# EAGLE design 16_FLAGS_Z_S (EAGLE 7.5.0)
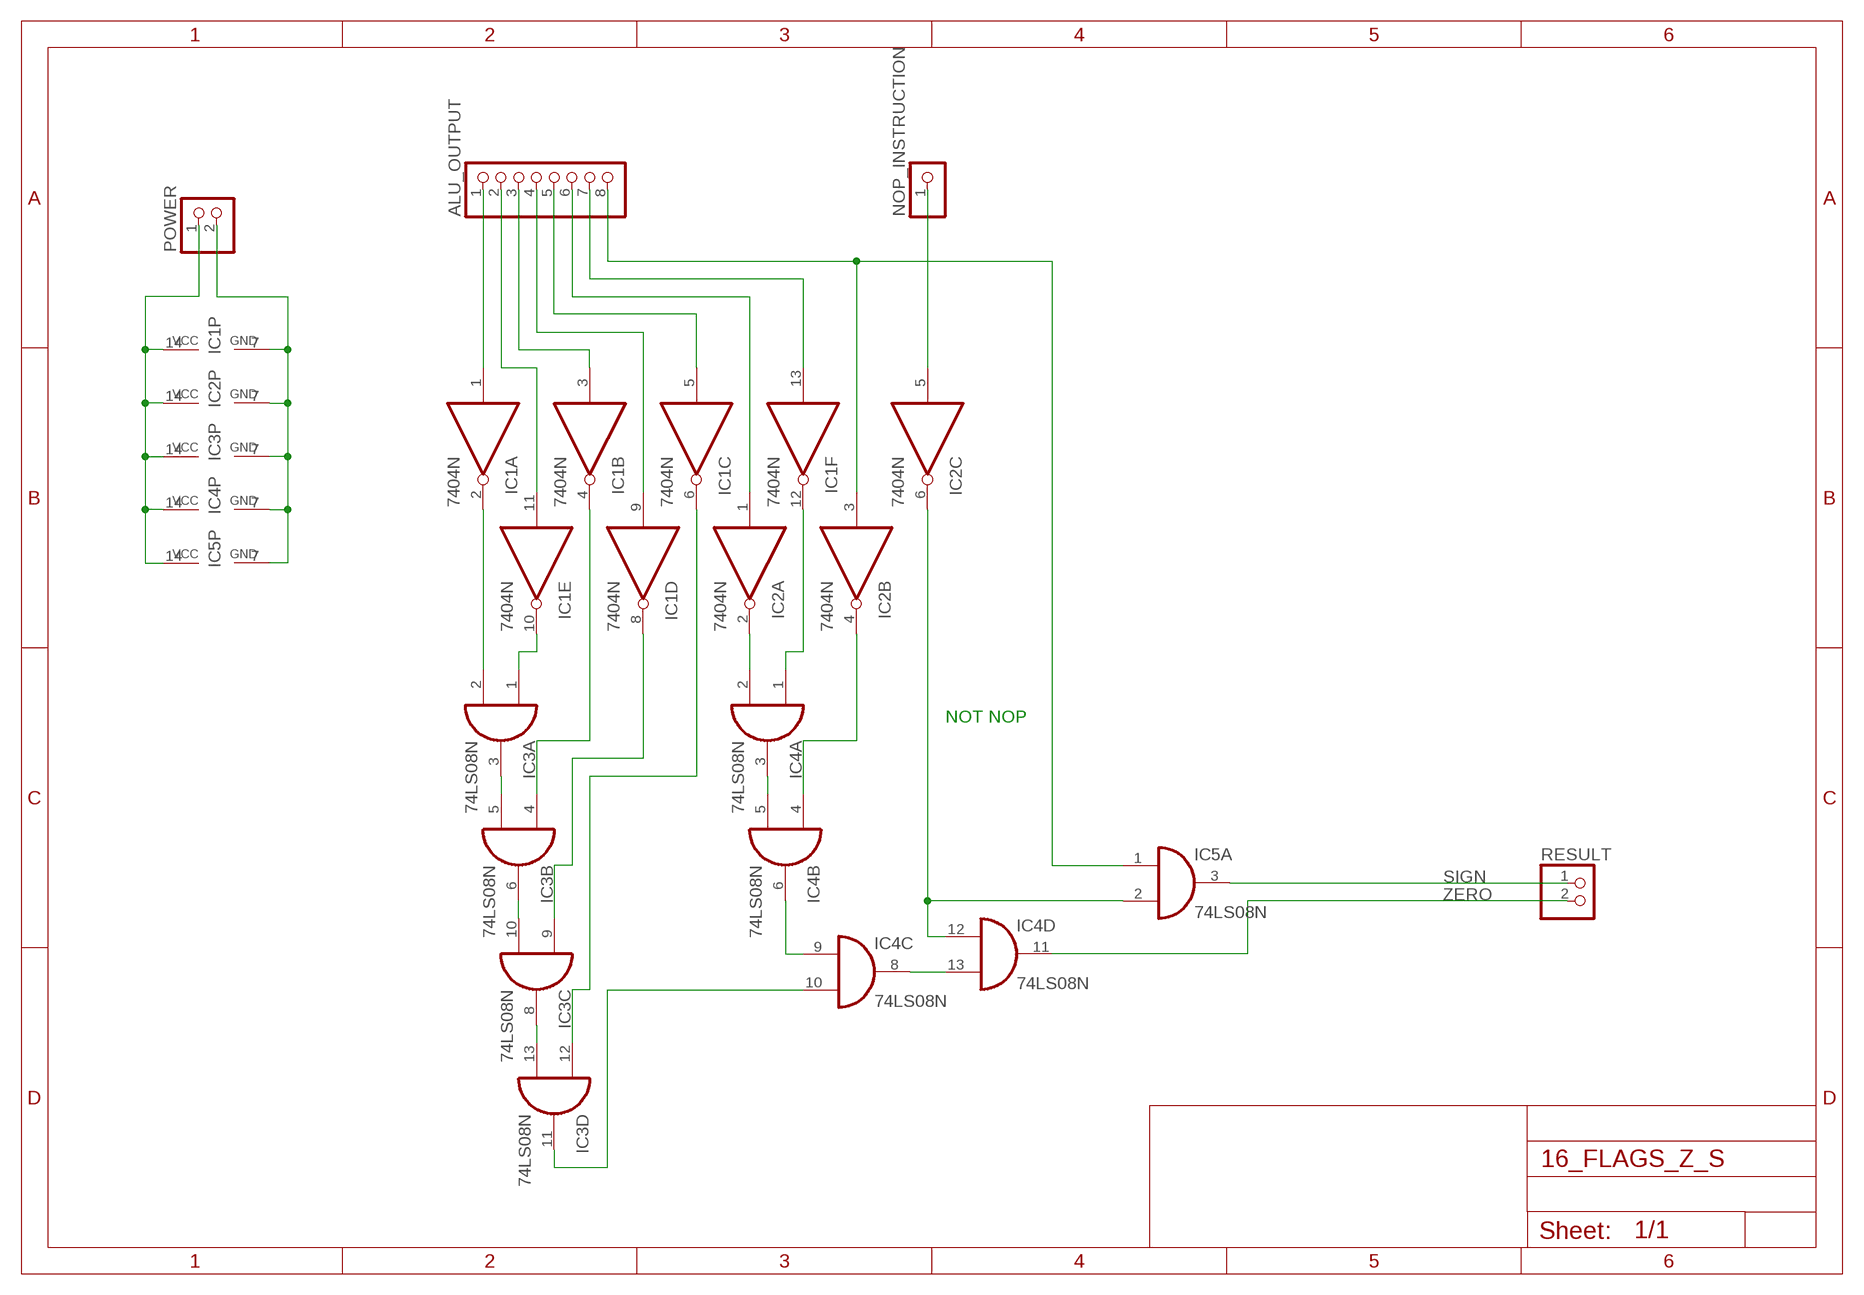
[diagram p0: schematic, sheet 1]

## Parts
ALU_OUTPUT  PINHD-1X8  [1X08]
IC1  7404N  [DIL14]
IC2  7404N  [DIL14]
IC3  74LS08N  [DIL14]
IC4  74LS08N  [DIL14]
IC5  74LS08N  [DIL14]
NOP_INSTRUCTION  PINHD-1X1  [1X01]
POWER  PINHD-1X2  [1X02]
RESULT  PINHD-1X2  [1X02]

## Nets
ALU_OUTPUT_1: ALU_OUTPUT.1 IC1.1(A:I)
ALU_OUTPUT_2: ALU_OUTPUT.2 IC1.11(E:I)
ALU_OUTPUT_3: ALU_OUTPUT.3 IC1.3(B:I)
ALU_OUTPUT_4: ALU_OUTPUT.4 IC1.9(D:I)
ALU_OUTPUT_5: ALU_OUTPUT.5 IC1.5(C:I)
ALU_OUTPUT_6: ALU_OUTPUT.6 IC2.1(A:I)
ALU_OUTPUT_7: ALU_OUTPUT.7 IC1.13(F:I)
ALU_OUTPUT_8: ALU_OUTPUT.8 IC2.3(B:I) IC5.1(A:I0)
GND: IC1.7(P:GND) IC2.7(P:GND) IC3.7(P:GND) IC4.7(P:GND) IC5.7(P:GND) POWER.2
N$4: IC1.10(E:O) IC3.1(A:I0)
N$10: IC1.2(A:O) IC3.2(A:I1)
N$11: IC1.4(B:O) IC3.4(B:I0)
N$12: IC1.6(C:O) IC3.12(D:I0)
N$13: IC1.12(F:O) IC4.1(A:I0)
N$14: IC3.3(A:O) IC3.5(B:I1)
N$15: IC3.6(B:O) IC3.10(C:I1)
N$16: IC1.8(D:O) IC3.9(C:I0)
N$17: IC3.8(C:O) IC3.13(D:I1)
N$18: IC2.2(A:O) IC4.2(A:I1)
N$19: IC4.3(A:O) IC4.5(B:I1)
N$20: IC2.4(B:O) IC4.4(B:I0)
N$21: IC4.6(B:O) IC4.9(C:I0)
N$22: IC3.11(D:O) IC4.10(C:I1)
N$24: IC2.6(C:O) IC4.12(D:I0) IC5.2(A:I1)
N$25: IC4.8(C:O) IC4.13(D:I1)
NOP_INSTRUCTION: IC2.5(C:I) NOP_INSTRUCTION.1
SIGN: IC5.3(A:O) RESULT.1
VCC: IC1.14(P:VCC) IC2.14(P:VCC) IC3.14(P:VCC) IC4.14(P:VCC) IC5.14(P:VCC) POWER.1
ZERO: IC4.11(D:O) RESULT.2
Unconnected: IC2.8(D:O) IC2.9(D:I) IC2.10(E:O) IC2.11(E:I) IC2.12(F:O) IC2.13(F:I) IC5.4(B:I0) IC5.5(B:I1) IC5.6(B:O) IC5.8(C:O) IC5.9(C:I0) IC5.10(C:I1) IC5.11(D:O) IC5.12(D:I0) IC5.13(D:I1)

## Notes on the sheet
- NOT NOP

## Library data of the parts
ALU_OUTPUT = pinhead:PINHD-1X8: PIN HEADER
IC1 IC2 = 74xx-eu:74*04: Hex INVERTER
IC3-IC5 = 74xx-eu:74*08: Quad 2-input AND gate
NOP_INSTRUCTION = pinhead:PINHD-1X1: PIN HEADER
POWER RESULT = pinhead:PINHD-1X2: PIN HEADER

## Board
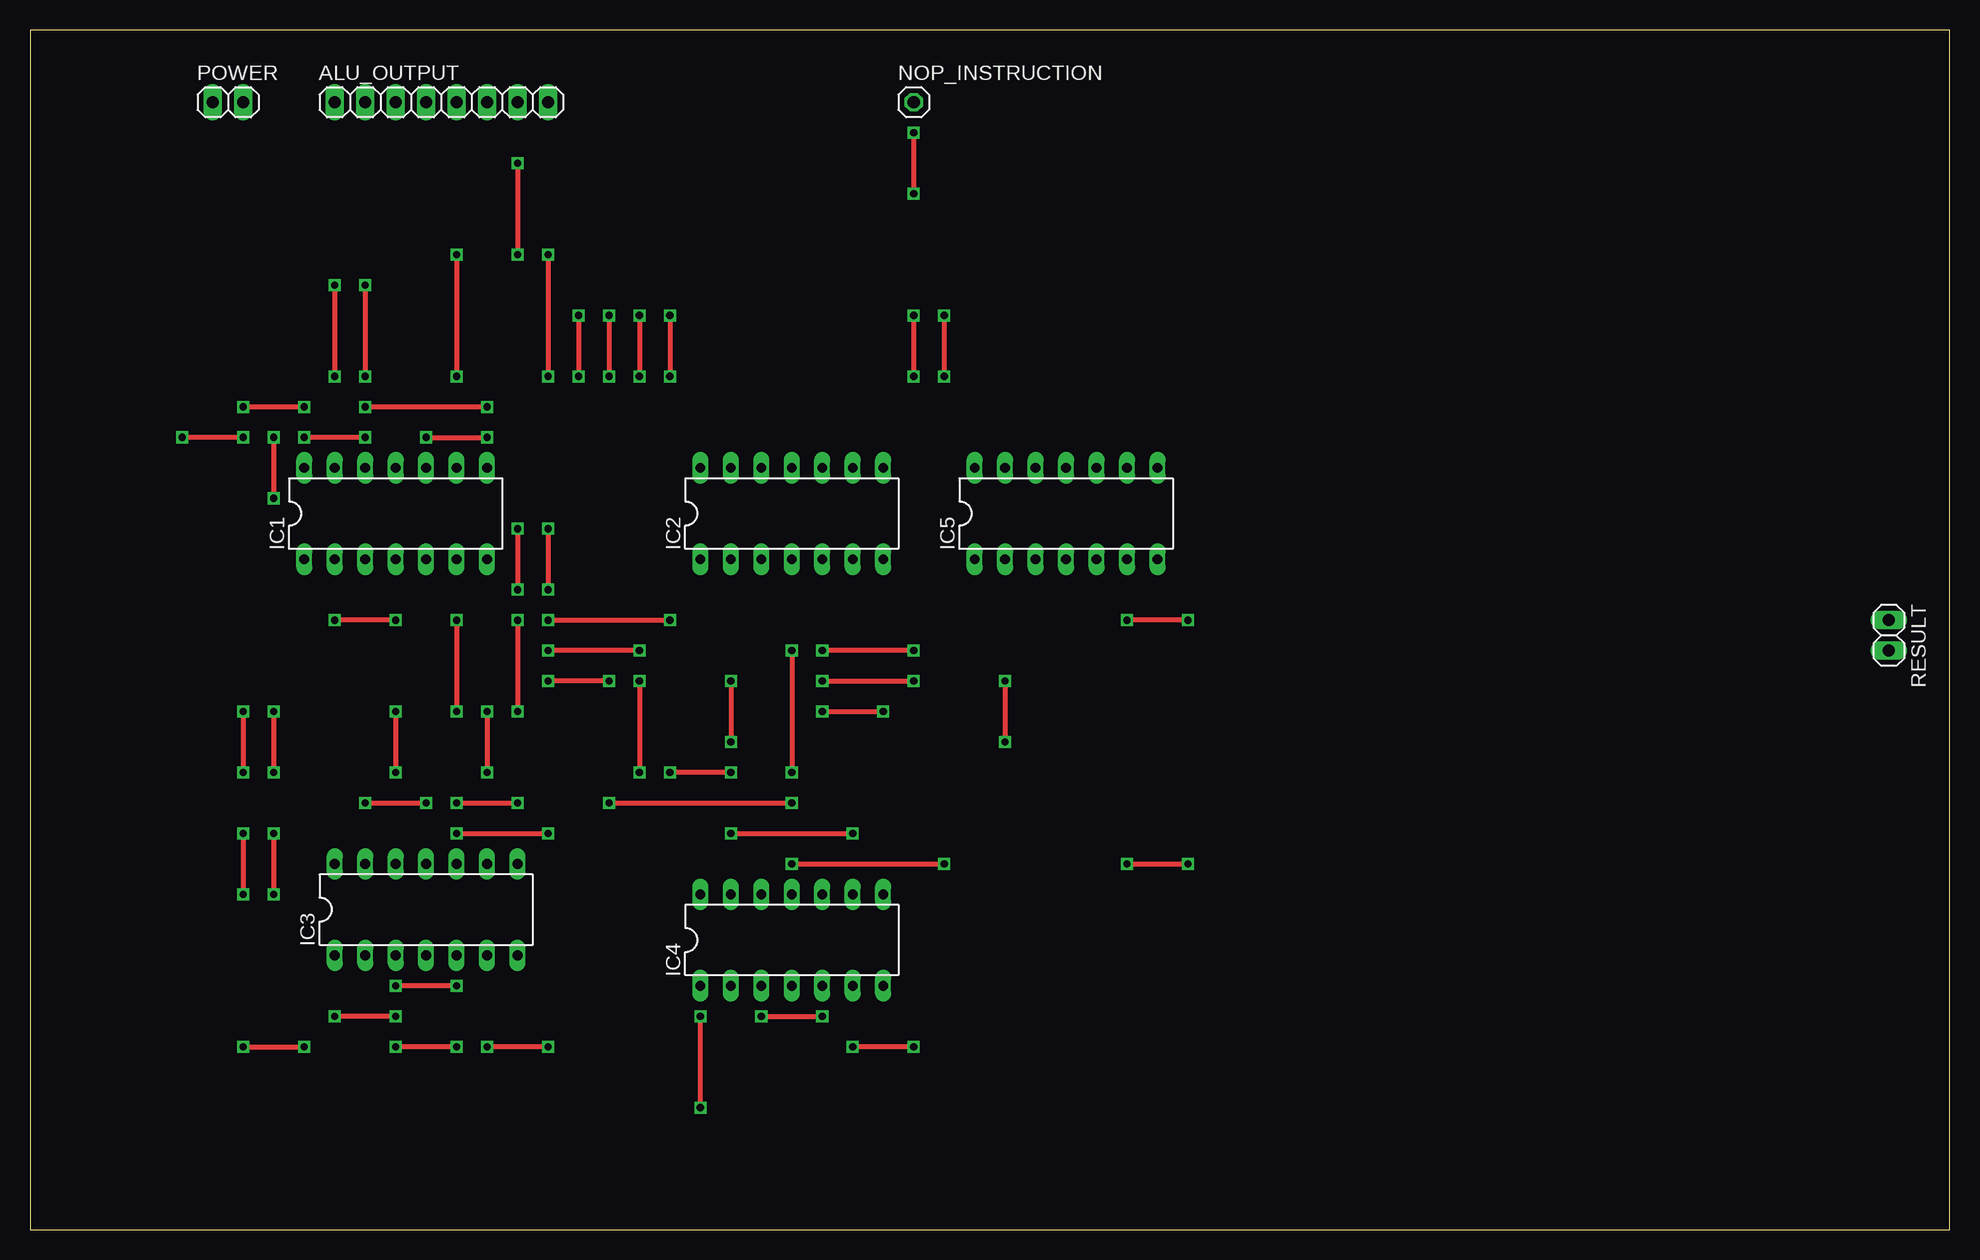
[diagram p1: board, top side]
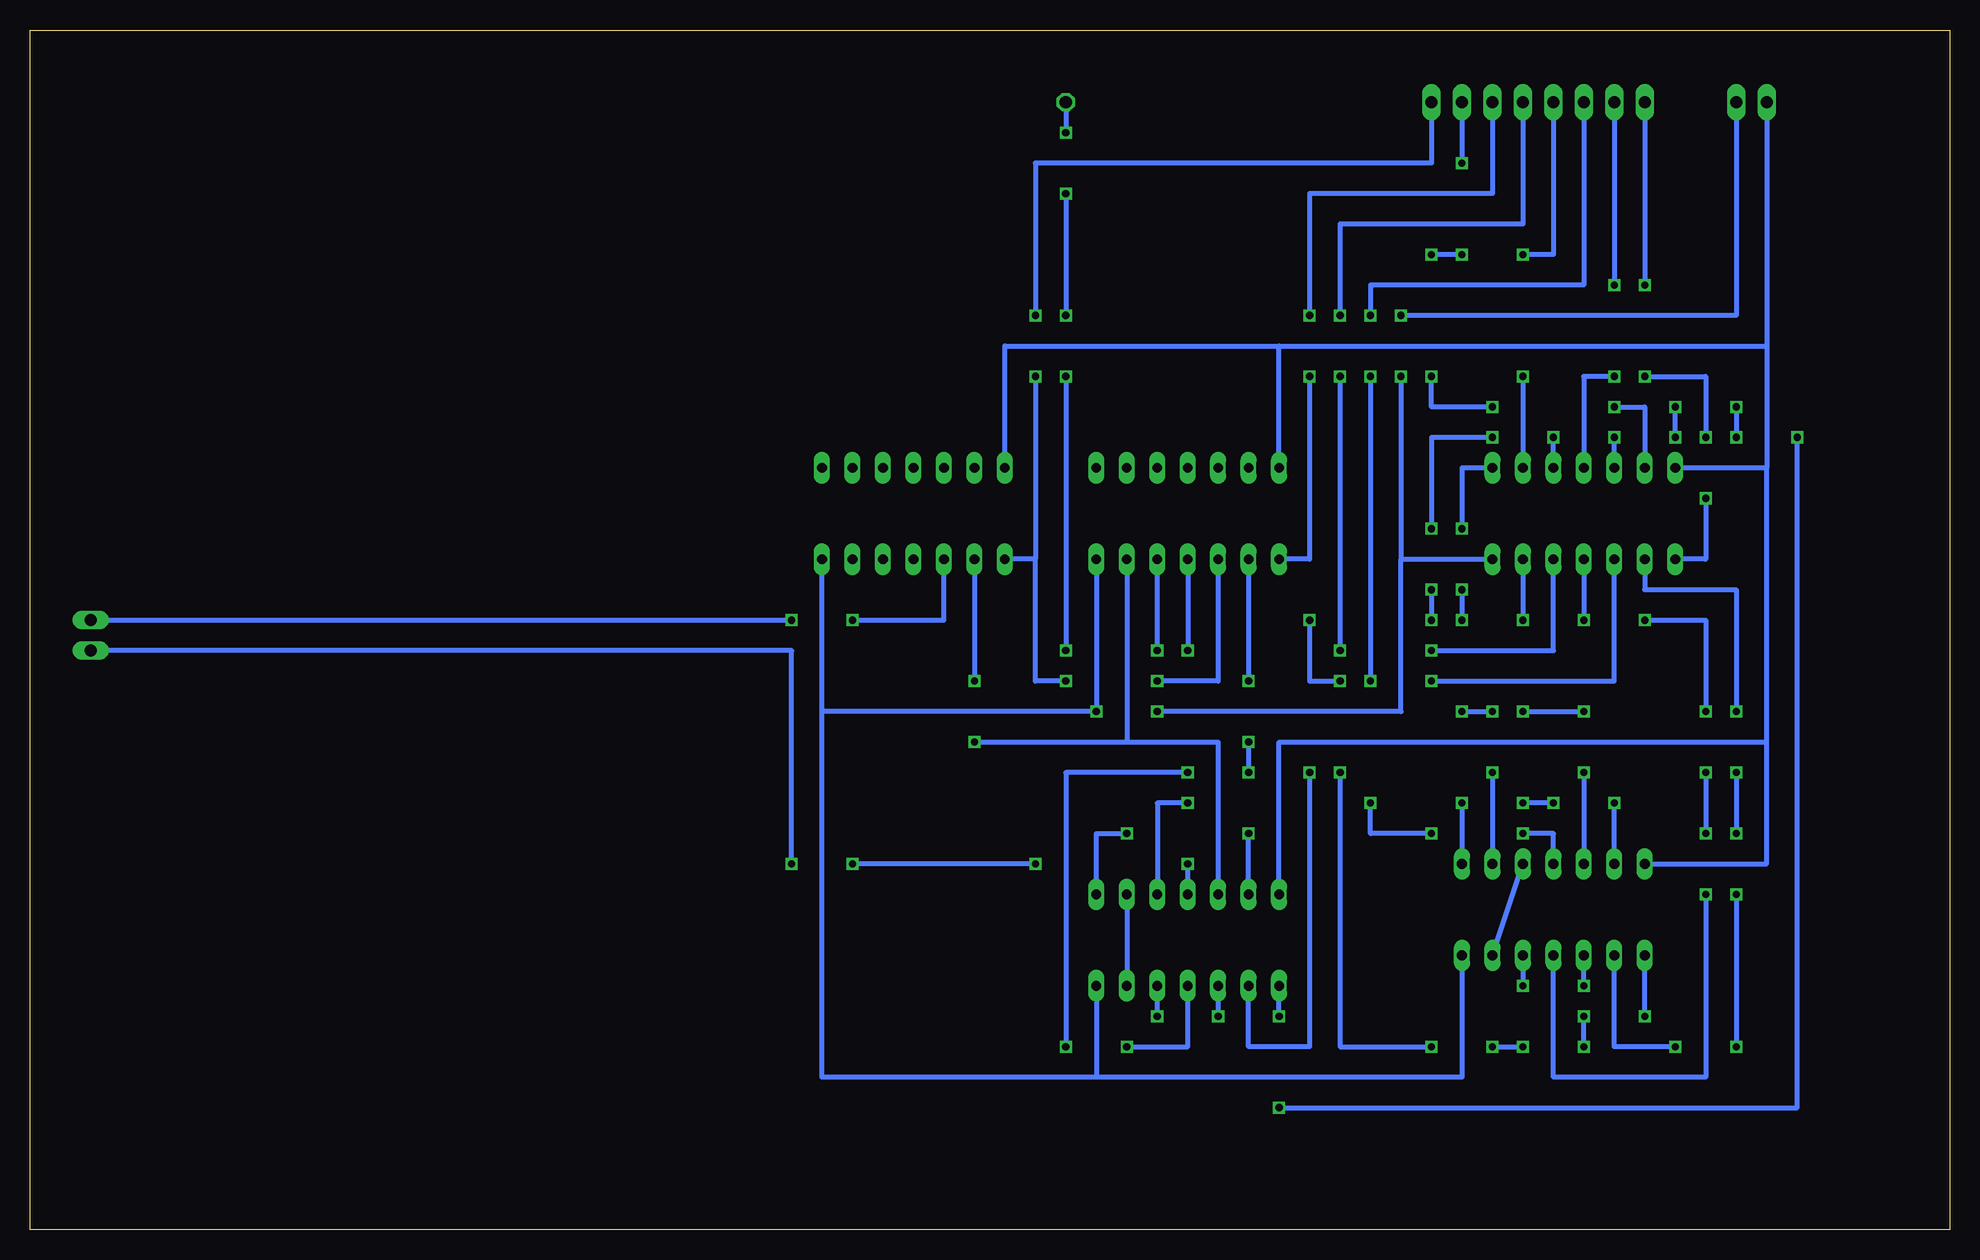
[diagram p2: board, bottom side, seen from below]

Size 160 x 100 mm. Coordinates in mm from the lower left corner, seen from the top.
Outline: 0,0 160,0 160,100 0,100 0,0
Copper layers (1*16): Top 0.035mm / dielectric 1.5mm / Bottom 0.035mm
Design rules "default": minimum track width 10mil, minimum drill 24mil, track to track 8mil, track to pad 8mil, pad to pad 8mil, via to via 8mil, smd to smd 8mil, copper to edge 40mil, drill to drill 8mil, minimum pad ring 10mil, minimum via ring 8mil, stop-mask expansion 4mil, vias tented up to drill 0mil, thermal gap 10mil

### Footprints (pad centres in the part's own frame; a part is rotated, then mirrored left to right if it is on the bottom)
1X08 = drill 1.016 long: 1 -8.89,0; 2 -6.35,0; 3 -3.81,0; 4 -1.27,0; 5 1.27,0; 6 3.81,0; 7 6.35,0; 8 8.89,0
DIL14 = drill 0.813 long: 1 -7.62,-3.81; 2 -5.08,-3.81; 3 -2.54,-3.81; 4 0,-3.81; 5 2.54,-3.81; 6 5.08,-3.81; 7 7.62,-3.81; 8 7.62,3.81; 9 5.08,3.81; 10 2.54,3.81; 11 0,3.81; 12 -2.54,3.81; 13 -5.08,3.81; 14 -7.62,3.81
1X01 = drill 1.016 octagon: 1 0,0
1X02 = drill 1.016 long: 1 -1.27,0; 2 1.27,0

### Placement (x,y rotation side)
ALU_OUTPUT  34.29,93.98 0 top
IC1  30.48,59.69 0 top
IC2  63.5,59.69 0 top
IC3  33.02,26.67 0 top
IC4  63.5,24.13 0 top
IC5  86.36,59.69 0 top
NOP_INSTRUCTION  73.66,93.98 0 top
POWER  16.51,93.98 0 top
RESULT  154.94,49.53 270 top

### Tracks (layer width: path | path; a pad name or v marks a point on that pad's centre or on a via)
ALU_OUTPUT_1  (via drill 0.6)
  Top 0.406: v25.4,78.74 v25.4,71.12 | v20.32,66.04 v20.32,60.96
  Bottom 0.406: ALU_OUTPUT.1 v25.4,78.74 | v25.4,71.12 20.32,71.12 v20.32,66.04 | v20.32,60.96 20.32,55.88 IC1.1
ALU_OUTPUT_2  (via drill 0.6)
  Top 0.406: v27.94,78.74 v27.94,71.12
  Bottom 0.406: ALU_OUTPUT.2 v27.94,78.74 | v27.94,71.12 30.48,71.12 IC1.11
ALU_OUTPUT_3  (via drill 0.6)
  Top 0.406: v48.26,76.2 v48.26,71.12 | v48.26,45.72 v43.18,45.72
  Bottom 0.406: ALU_OUTPUT.3 30.48,78.74 48.26,78.74 v48.26,76.2 | v48.26,71.12 v48.26,45.72 | v43.18,45.72 27.94,45.72 IC1.3
ALU_OUTPUT_4  (via drill 0.6)
  Top 0.406: v35.56,81.28 v35.56,71.12
  Bottom 0.406: ALU_OUTPUT.4 33.02,81.28 v35.56,81.28 | v35.56,71.12 IC1.9
ALU_OUTPUT_5  (via drill 0.6)
  Top 0.406: v50.8,76.2 v50.8,71.12 | v50.8,48.26 v43.18,48.26
  Bottom 0.406: ALU_OUTPUT.5 35.56,83.82 50.8,83.82 v50.8,76.2 | v50.8,71.12 v50.8,48.26 | v43.18,48.26 33.02,48.26 IC1.5
ALU_OUTPUT_6  (via drill 0.6)
  Top 0.406: v53.34,76.2 v53.34,71.12
  Bottom 0.406: ALU_OUTPUT.6 38.1,86.36 53.34,86.36 v53.34,76.2 | v53.34,71.12 53.34,55.88 IC2.1
ALU_OUTPUT_7  (via drill 0.6)
  Top 0.406: v40.64,88.9 v40.64,81.28 | v43.18,81.28 v43.18,71.12 | v38.1,68.58 v27.94,68.58
  Bottom 0.406: ALU_OUTPUT.7 v40.64,88.9 | v40.64,81.28 v43.18,81.28 | v27.94,68.58 25.4,68.58 IC1.13 | v38.1,68.58 43.18,68.58 v43.18,71.12
ALU_OUTPUT_8  (via drill 0.6)
  Top 0.406: v76.2,76.2 v76.2,71.12 | v66.04,45.72 v73.66,45.72
  Bottom 0.406: ALU_OUTPUT.8 43.18,88.9 76.2,88.9 v76.2,76.2 | v76.2,71.12 76.2,55.88 | 76.2,55.88 IC5.1 | IC2.3 60.96,45.72 v66.04,45.72 | v73.66,45.72 76.2,45.72 76.2,55.88
GND  (via drill 0.6)
  Top 0.406: v45.72,76.2 v45.72,71.12 | v66.04,43.18 v71.12,43.18
  Bottom 0.406: POWER.2 17.78,76.2 v45.72,76.2 | v45.72,71.12 45.72,55.88 | 45.72,55.88 IC1.7 | IC2.7 v71.12,43.18 93.98,43.18 | 45.72,55.88 45.72,43.18 v66.04,43.18 | IC3.7 40.64,12.7 71.12,12.7 | 71.12,12.7 93.98,12.7 93.98,43.18 | 93.98,43.18 IC5.7 | IC4.7 71.12,12.7
N$4  (via drill 0.6)
  Top 0.406: v33.02,66.04 v38.1,66.04 | v43.18,58.42 v43.18,53.34 | v43.18,50.8 v53.34,50.8 | v50.8,45.72 v50.8,38.1 | v43.18,15.24 v38.1,15.24 | v35.56,15.24 v30.48,15.24 | v30.48,17.78 v25.4,17.78
  Bottom 0.406: IC1.10 v33.02,66.04 | v38.1,66.04 43.18,66.04 v43.18,58.42 | v43.18,53.34 v43.18,50.8 | v53.34,50.8 53.34,45.72 v50.8,45.72 | v50.8,38.1 50.8,15.24 v43.18,15.24 | v38.1,15.24 v35.56,15.24 | v30.48,15.24 v30.48,17.78 | v25.4,17.78 IC3.1
N$10  (via drill 0.6)
  Top 0.406: v17.78,43.18 v17.78,38.1 | v17.78,33.02 v17.78,27.94 | v17.78,15.24 v22.86,15.24
  Bottom 0.406: IC1.2 25.4,53.34 17.78,53.34 v17.78,43.18 | v17.78,38.1 v17.78,33.02 | v17.78,27.94 v17.78,15.24 | v22.86,15.24 27.94,15.24 IC3.2
N$11  (via drill 0.6)
  Top 0.406: v30.48,50.8 v25.4,50.8 | v20.32,43.18 v20.32,38.1 | v20.32,33.02 v20.32,27.94
  Bottom 0.406: IC1.4 v30.48,50.8 | v25.4,50.8 20.32,50.8 v20.32,43.18 | v20.32,38.1 v20.32,33.02 | v20.32,27.94 20.32,12.7 33.02,12.7 IC3.4
N$12  (via drill 0.6)
  Top 0.406: v35.56,50.8 v35.56,43.18 | v30.48,43.18 v30.48,38.1
  Bottom 0.406: IC1.6 v35.56,50.8 | v35.56,43.18 v30.48,43.18 | v30.48,38.1 IC3.12
N$13  (via drill 0.6)
  Top 0.406: v27.94,66.04 v22.86,66.04 | v22.86,68.58 v17.78,68.58 | v17.78,66.04 v12.7,66.04 | v55.88,10.16 v55.88,17.78
  Bottom 0.406: IC1.12 v27.94,66.04 | v22.86,66.04 v22.86,68.58 | v17.78,68.58 v17.78,66.04 | v55.88,17.78 IC4.1 | v55.88,10.16 12.7,10.16 v12.7,66.04
N$14  (via drill 0.6)
  Top 0.406: v35.56,20.32 v30.48,20.32
  Bottom 0.406: IC3.5 v35.56,20.32 | v30.48,20.32 IC3.3
N$15
  Bottom 0.406: IC3.6 IC3.10
N$16  (via drill 0.6)
  Top 0.406: v40.64,58.42 v40.64,53.34 | v40.64,50.8 v40.64,43.18 | v38.1,43.18 v38.1,38.1
  Bottom 0.406: IC1.8 40.64,63.5 v40.64,58.42 | v40.64,53.34 v40.64,50.8 | v40.64,43.18 v38.1,43.18 | v38.1,38.1 IC3.9
N$17  (via drill 0.6)
  Top 0.406: v27.94,35.56 v33.02,35.56 | v35.56,35.56 v40.64,35.56
  Bottom 0.406: IC3.13 v27.94,35.56 | v33.02,35.56 v35.56,35.56 | v40.64,35.56 IC3.8
N$18  (via drill 0.6)
  Top 0.406: v58.42,45.72 v58.42,40.64 | v58.42,38.1 v53.34,38.1
  Bottom 0.406: IC2.2 v58.42,45.72 | v58.42,40.64 v58.42,38.1 | v53.34,38.1 53.34,15.24 58.42,15.24 IC4.2
N$19  (via drill 0.6)
  Top 0.406: v60.96,17.78 v66.04,17.78
  Bottom 0.406: IC4.3 v60.96,17.78 | v66.04,17.78 IC4.5
N$20  (via drill 0.6)
  Top 0.406: v63.5,48.26 v63.5,38.1 | v73.66,15.24 v68.58,15.24
  Bottom 0.406: IC2.4 v63.5,48.26 | v63.5,38.1 73.66,38.1 v73.66,15.24 | v68.58,15.24 63.5,15.24 IC4.4
N$21
  Bottom 0.406: IC4.9 IC4.6
N$22  (via drill 0.6)
  Top 0.406: v35.56,33.02 v43.18,33.02 | v48.26,35.56 v63.5,35.56
  Bottom 0.406: IC3.11 33.02,33.02 v35.56,33.02 | v43.18,33.02 48.26,33.02 v48.26,35.56 | v63.5,35.56 66.04,35.56 IC4.10
N$24  (via drill 0.6)
  Top 0.406: v81.28,45.72 v81.28,40.64
  Bottom 0.406: IC2.6 68.58,40.64 | 68.58,40.64 60.96,40.64 IC4.12 | IC5.2 v81.28,45.72 | v81.28,40.64 68.58,40.64
N$25  (via drill 0.6)
  Top 0.406: v58.42,33.02 v68.58,33.02
  Bottom 0.406: IC4.13 v58.42,33.02 | IC4.8 71.12,33.02 v68.58,33.02
NOP_INSTRUCTION  (via drill 0.6)
  Top 0.406: v73.66,91.44 v73.66,86.36 | v73.66,76.2 v73.66,71.12 | v73.66,48.26 v66.04,48.26
  Bottom 0.406: NOP_INSTRUCTION.1 v73.66,91.44 | v73.66,86.36 v73.66,76.2 | v73.66,71.12 v73.66,48.26 | v66.04,48.26 IC2.5
SIGN  (via drill 0.6)
  Top 0.406: v96.52,50.8 v91.44,50.8
  Bottom 0.406: RESULT.1 v96.52,50.8 | v91.44,50.8 83.82,50.8 IC5.3
VCC
  Bottom 0.406: POWER.1 15.24,73.66 | 15.24,73.66 15.24,63.5 | 15.24,63.5 IC1.14 | IC3.14 15.24,30.48 15.24,40.64 | 15.24,40.64 15.24,63.5 | IC2.14 55.88,73.66 | 55.88,73.66 15.24,73.66 | IC4.14 55.88,40.64 15.24,40.64 | IC5.14 78.74,73.66 55.88,73.66
ZERO  (via drill 0.6)
  Top 0.406: v63.5,30.48 v76.2,30.48 | v91.44,30.48 v96.52,30.48
  Bottom 0.406: IC4.11 v63.5,30.48 | v76.2,30.48 v91.44,30.48 | v96.52,30.48 96.52,48.26 RESULT.2